# Altium schematic sheet MCU_CONNECTA.SchDoc
size A2
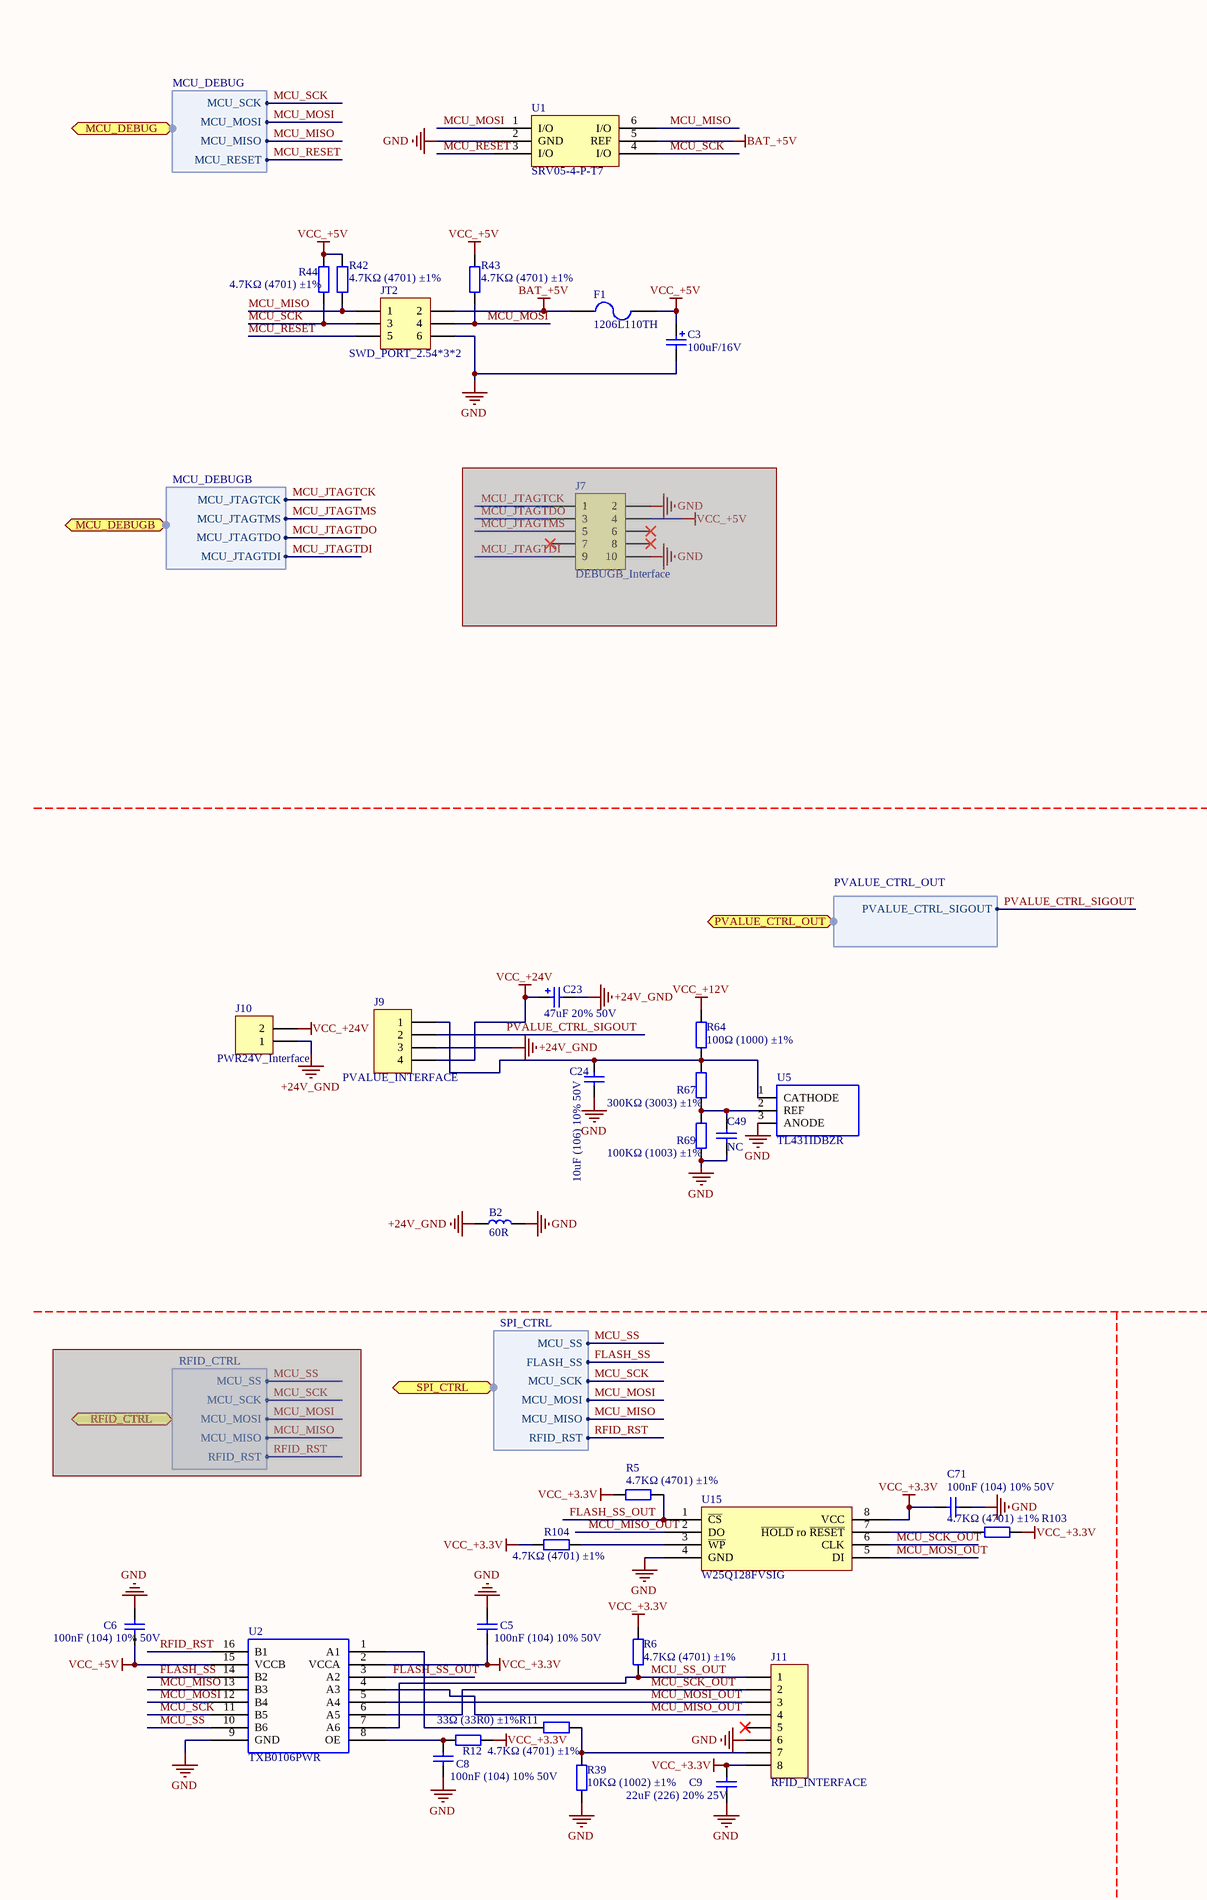
[diagram p0: MCU_CONNECTA.SchDoc, left]
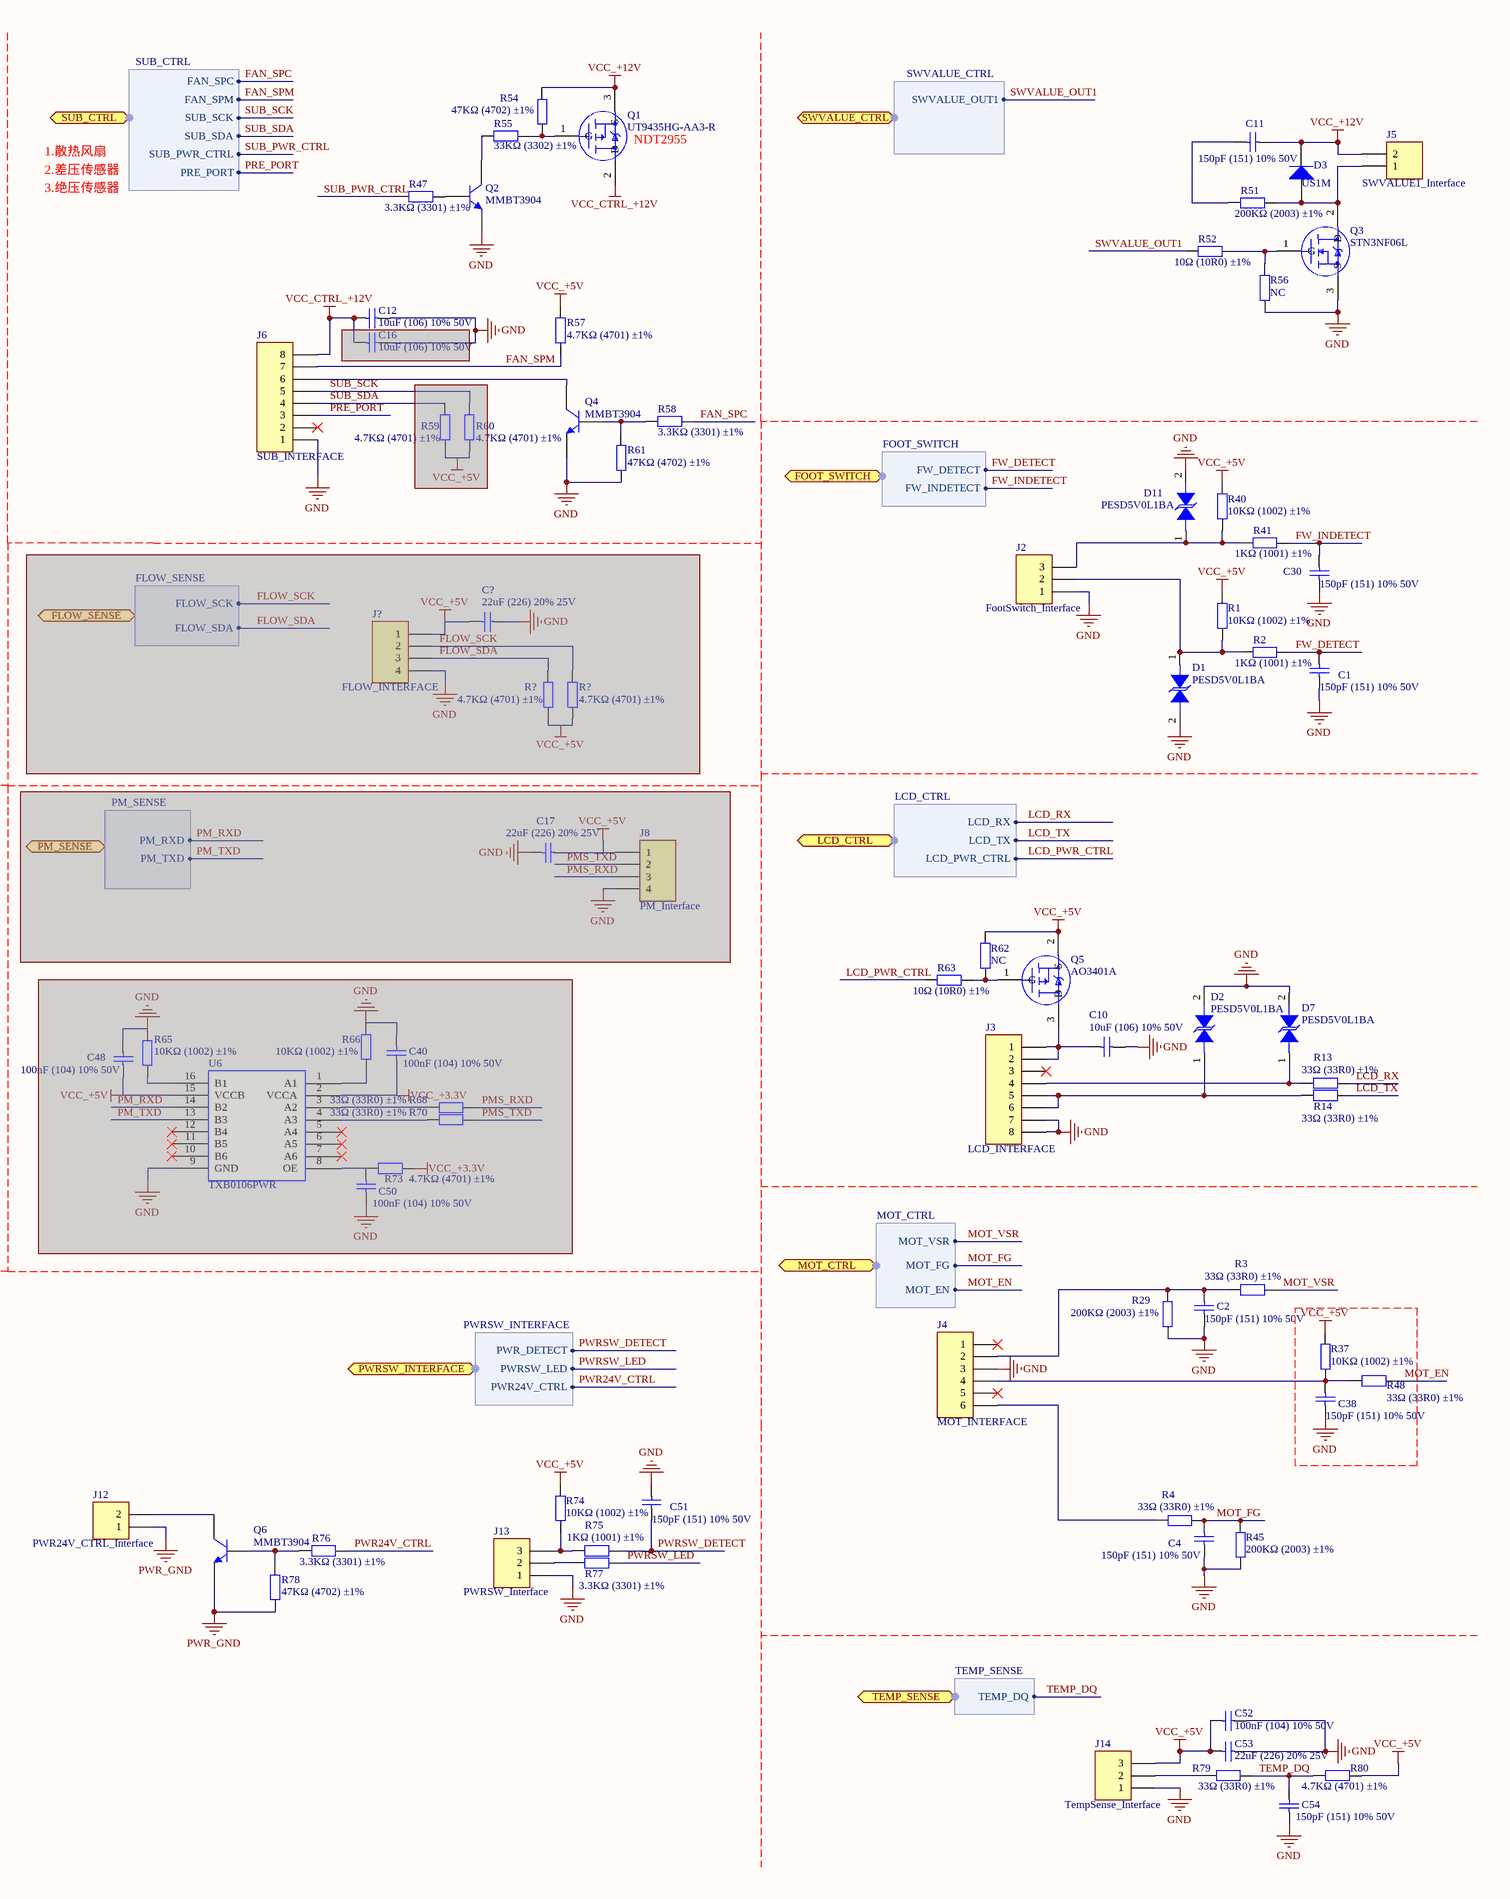
[diagram p1: MCU_CONNECTA.SchDoc, right]

## Parts
(Parts that share a designator on the sheet are numbered #1, #2 ... from top to bottom, then left to right.)
B2  60R  [LC-0805_L]
C1  150pF (151) 10% 50V  [LC-0603_C]
C2  150pF (151) 10% 50V  [LC-0603_C]
C3  100uF/16V  [RCCT-6032C]
C4  150pF (151) 10% 50V  [LC-0603_C]
C5  100nF (104) 10% 50V  [LC-0603_C]
C6  100nF (104) 10% 50V  [LC-0603_C]
C8  100nF (104) 10% 50V  [LC-0603_C]
C9  22uF (226) 20% 25V  [LC-0805_C]
C10  10uF (106) 10% 50V  [LC-1206_C]
C11  150pF (151) 10% 50V  [LC-0603_C]
C12  10uF (106) 10% 50V  [LC-1206_C]
C16  10uF (106) 10% 50V  [LC-1206_C]
C17  22uF (226) 20% 25V  [LC-0805_C]  (masked out: inside a compile mask, not in the netlist)
C23  47uF 20% 50V  [RCC-AL-EC-6.3*7.7-TH]
C24  10uF (106) 10% 50V  [LC-1206_C]
C30  150pF (151) 10% 50V  [LC-0603_C]
C38  150pF (151) 10% 50V  [LC-0603_C]
C40  100nF (104) 10% 50V  [LC-0603_C]  (masked out: inside a compile mask, not in the netlist)
C48  100nF (104) 10% 50V  [LC-0603_C]  (masked out: inside a compile mask, not in the netlist)
C49  NC  [LC-0603_C]
C50  100nF (104) 10% 50V  [LC-0603_C]  (masked out: inside a compile mask, not in the netlist)
C51  150pF (151) 10% 50V  [LC-0603_C]
C52  100nF (104) 10% 50V  [LC-0603_C]
C53  22uF (226) 20% 25V  [LC-0805_C]
C54  150pF (151) 10% 50V  [LC-0603_C]
C71  100nF (104) 10% 50V  [LC-0603_C]
C?  22uF (226) 20% 25V  [LC-0805_C]  (masked out: inside a compile mask, not in the netlist)
D1  PESD5V0L1BA  [RCD-SOD323-N]
D2  PESD5V0L1BA  [RCD-SOD323-N]
D3  US1M  [LC-SMA(DO-214AC)_S1]
D7  PESD5V0L1BA  [RCD-SOD323-N]
D11  PESD5V0L1BA  [RCD-SOD323-N]
F1  1206L110TH  [RCF1206TH]
J2  FootSwitch_Interface  [RCJ2.5-3CA]
J3  LCD_INTERFACE  [RCJ-XH2.54-8P]
J4  MOT_INTERFACE  [RCJ-XH2.54-6P]
J5  SWVALUE1_Interface  [RCJ3.96-2CA]
J6  SUB_INTERFACE  [RCJ-XH2.54-8P]
J7  DEBUGB_Interface  [RCJ2.5-2X5CA]  (masked out: inside a compile mask, not in the netlist)
J8  PM_Interface  [RCJ2.5-4CA]  (masked out: inside a compile mask, not in the netlist)
J9  PVALUE_INTERFACE  [RCJ2.5-4CA]
J10  PWR24V_Interface  [RCJ3.96-2CA]
J11  RFID_INTERFACE  [RCJ-XH2.54-8P]
J12  PWR24V_CTRL_Interface  [RCJ-XH2.54-2P]
J13  PWRSW_Interface  [RCJ2.5-3CA]
J14  TempSense_Interface  [RCJ2.5-3CA]
J?  FLOW_INTERFACE  (masked out: inside a compile mask, not in the netlist)
JT2  SWD_PORT_2.54*3*2  [RCJ2.5-2X3CA]
Q1  UT9435HG-AA3-R  [LC-SOT-223]
Q2  MMBT3904  [LC-SOT-23(SOT-23-3)]
Q3  STN3NF06L  [LC-SOT-223]
Q4  MMBT3904  [LC-SOT-23(SOT-23-3)]
Q5  AO3401A  [LC-SOT-23-3L]
Q6  MMBT3904  [LC-SOT-23(SOT-23-3)]
R1  10KΩ (1002) ±1%  [LC-0603_R]
R2  1KΩ (1001) ±1%  [LC-0603_R]
R3  33Ω (33R0) ±1%  [LC-0603_R]
R4  33Ω (33R0) ±1%  [LC-0603_R]
R5  4.7KΩ (4701) ±1%  [LC-0603_R]
R6  4.7KΩ (4701) ±1%  [LC-0603_R]
R11  33Ω (33R0) ±1%  [LC-0603_R]
R12  4.7KΩ (4701) ±1%  [LC-0603_R]
R13  33Ω (33R0) ±1%  [LC-0603_R]
R14  33Ω (33R0) ±1%  [LC-0603_R]
R29  200KΩ (2003) ±1%  [LC-0603_R]
R37  10KΩ (1002) ±1%  [LC-0603_R]
R39  10KΩ (1002) ±1%  [LC-0603_R]
R40  10KΩ (1002) ±1%  [LC-0603_R]
R41  1KΩ (1001) ±1%  [LC-0603_R]
R42  4.7KΩ (4701) ±1%  [LC-0603_R]
R43  4.7KΩ (4701) ±1%  [LC-0603_R]
R44  4.7KΩ (4701) ±1%  [LC-0603_R]
R45  200KΩ (2003) ±1%  [LC-0603_R]
R47  3.3KΩ (3301) ±1%  [LC-0603_R]
R48  33Ω (33R0) ±1%  [LC-0603_R]
R51  200KΩ (2003) ±1%  [LC-0603_R]
R52  10Ω (10R0) ±1%  [LC-0603_R]
R54  47KΩ (4702) ±1%  [LC-0603_R]
R55  33KΩ (3302) ±1%  [LC-0603_R]
R56  NC  [LC-0603_R]
R57  4.7KΩ (4701) ±1%  [LC-0603_R]
R58  3.3KΩ (3301) ±1%  [LC-0603_R]
R59  4.7KΩ (4701) ±1%  [LC-0603_R]  (masked out: inside a compile mask, not in the netlist)
R60  4.7KΩ (4701) ±1%  [LC-0603_R]  (masked out: inside a compile mask, not in the netlist)
R61  47KΩ (4702) ±1%  [LC-0603_R]
R62  NC  [LC-0603_R]
R63  10Ω (10R0) ±1%  [LC-0603_R]
R64  100Ω (1000) ±1%  [LC-0603_R]
R65  10KΩ (1002) ±1%  [LC-0603_R]  (masked out: inside a compile mask, not in the netlist)
R66  10KΩ (1002) ±1%  [LC-0603_R]  (masked out: inside a compile mask, not in the netlist)
R67  300KΩ (3003) ±1%  [LC-0603_R]
R68  33Ω (33R0) ±1%  [LC-0603_R]  (masked out: inside a compile mask, not in the netlist)
R69  100KΩ (1003) ±1%  [LC-0603_R]
R70  33Ω (33R0) ±1%  [LC-0603_R]  (masked out: inside a compile mask, not in the netlist)
R73  4.7KΩ (4701) ±1%  [LC-0603_R]  (masked out: inside a compile mask, not in the netlist)
R74  10KΩ (1002) ±1%  [LC-0603_R]
R75  1KΩ (1001) ±1%  [LC-0603_R]
R76  3.3KΩ (3301) ±1%  [LC-0603_R]
R77  3.3KΩ (3301) ±1%  [LC-0603_R]
R78  47KΩ (4702) ±1%  [LC-0603_R]
R79  33Ω (33R0) ±1%  [LC-0603_R]
R80  4.7KΩ (4701) ±1%  [LC-0603_R]
R103  4.7KΩ (4701) ±1%  [LC-0603_R]
R104  4.7KΩ (4701) ±1%  [LC-0603_R]
R?#1  4.7KΩ (4701) ±1%  [LC-0603_R]  (masked out: inside a compile mask, not in the netlist)
R?#2  4.7KΩ (4701) ±1%  [LC-0603_R]  (masked out: inside a compile mask, not in the netlist)
U1  SRV05-4-P-T7  [LC-SOT-23-6]
U2  TXB0106PWR  [RCIC-TSSOP16]
U5  TL431IDBZR  [RC-SOT-23]
U6  TXB0106PWR  [RCIC-TSSOP16]  (masked out: inside a compile mask, not in the netlist)
U15  W25Q128FVSIG  [LC-SOIC-8_208mil]

## Ports
FLOW_SENSE (harness FLOW_SENSE), FOOT_SWITCH (harness FOOT_SWITCH), LCD_CTRL (harness LCD_CTRL), MCU_DEBUG (harness MCU_DEBUG), MCU_DEBUGB (harness MCU_DEBUGB), MOT_CTRL (harness MOT_CTRL), PM_SENSE (harness PM_SENSE), PVALUE_CTRL_OUT (harness PVALUE_CTRL_OUT), PWRSW_INTERFACE (harness PWRSW_INTERFACE), RFID_CTRL (harness RFID_CTRL), SPI_CTRL (harness SPI_CTRL), SUB_CTRL (harness SUB_CTRL), SWVALUE_CTRL (harness SWVALUE_CTRL), TEMP_SENSE (harness TEMP_SENSE)

## Harnesses
LCD_CTRL: LCD_RX, LCD_TX, LCD_PWR_CTRL
FOOT_SWITCH: FW_DETECT, FW_INDETECT
MOT_CTRL: MOT_VSR, MOT_FG, MOT_EN
FLOW_SENSE: FLOW_SCK, FLOW_SDA
TEMP_SENSE: TEMP_DQ
SWVALUE_CTRL: SWVALUE_OUT1
RFID_CTRL: MCU_SS, MCU_SCK, MCU_MOSI, MCU_MISO, RFID_RST
PM_SENSE: PM_RXD, PM_TXD
PWRSW_INTERFACE: PWR_DETECT, PWRSW_LED, PWR24V_CTRL
SUB_CTRL: FAN_SPC, FAN_SPM, SUB_SCK, SUB_SDA, SUB_PWR_CTRL, PRE_PORT
MCU_DEBUG: MCU_SCK, MCU_MOSI, MCU_MISO, MCU_RESET
MCU_DEBUGB: MCU_JTAGTCK, MCU_JTAGTMS, MCU_JTAGTDO, MCU_JTAGTDI
PVALUE_CTRL_OUT: PVALUE_CTRL_SIGOUT
SPI_CTRL: MCU_SS, MCU_SCK, MCU_MOSI, MCU_MISO, RFID_RST, FLASH_SS

## Nets
+24V_GND: B2.1 C23.2 J9.3 J10.1
BAT_+5V: F1.2 JT2.2 U1.5(REF)
GND: B2.2 C1.1 C2.1 C3.2 C4.1 C5.2 C6.2 C8.1 C9.1 C10.2 C12.2 C16.2 C24.2 C30.1 C38.1 C49.1 C51.2 C52.1 C53.2 C54.1 C71.1 D1.2 D2.2 D7.2 D11.2 J2.1 J3.7 J3.8 J4.3 J6.1 J11.6 J13.1 J14.1 JT2.6 Q2.2(E) Q3.3(S) Q4.2(E) R29.1 R39.1 R45.1 R56.1 R61.1 R69.2 U1.2(GND) U2.9(GND) U5.3(ANODE) U15.4(GND)
PWR_GND: J12.1 Q6.2(E) R78.1
VCC_+3.3V: C5.1 C9.2 C71.2 J11.8 R5.2 R6.1 R12.2 R103.1 R104.2 U2.2(VCCA) U15.8(VCC)
VCC_+5V: C3.1 C6.1 C52.2 C53.1 F1.1 J14.3 Q5.2(S) R1.2 R37.1 R40.2 R42.1 R43.1 R44.1 R57.2 R62.2 R74.2 R80.2 U2.15(VCCB)
VCC_+12V: C11.1 D3.2(K) J5.2 Q1.3(S) R54.2 R64.2
VCC_+24V: C23.1 J9.4 J10.2
VCC_CTRL_+12V: C12.1 C16.1 J6.8 Q1.2(D)
FAN_SPC: R58.2 ; port SUB_CTRL.FAN_SPC
FAN_SPM: J6.7 R57.1 ; port SUB_CTRL.FAN_SPM
FLASH_SS: U2.14(B2) ; port SPI_CTRL.FLASH_SS
FLASH_SS_OUT: R5.1 U2.3(A2) U15.1(~{CS})
FW_DETECT: C1.2 R2.2 ; port FOOT_SWITCH.FW_DETECT
FW_INDETECT: C30.2 R41.2 ; port FOOT_SWITCH.FW_INDETECT
LCD_PWR_CTRL: R63.1 ; port LCD_CTRL.LCD_PWR_CTRL
LCD_RX: R13.2 ; port LCD_CTRL.LCD_RX
LCD_TX: R14.2 ; port LCD_CTRL.LCD_TX
MCU_JTAGTCK: port MCU_DEBUGB.MCU_JTAGTCK
MCU_JTAGTDI: port MCU_DEBUGB.MCU_JTAGTDI
MCU_JTAGTDO: port MCU_DEBUGB.MCU_JTAGTDO
MCU_JTAGTMS: port MCU_DEBUGB.MCU_JTAGTMS
MCU_MISO: JT2.1 R42.2 U1.6(I/O) U2.13(B3) ; port MCU_DEBUG.MCU_MISO, port SPI_CTRL.MCU_MISO
MCU_MISO_OUT: J11.4 U2.4(A3) U15.2(DO)
MCU_MOSI: JT2.4 R43.2 U1.1(I/O) U2.12(B4) ; port MCU_DEBUG.MCU_MOSI, port SPI_CTRL.MCU_MOSI
MCU_MOSI_OUT: J11.3 U2.5(A4) U15.5(DI)
MCU_RESET: JT2.5 U1.3(I/O) ; port MCU_DEBUG.MCU_RESET
MCU_SCK: JT2.3 R44.2 U1.4(I/O) U2.11(B5) ; port MCU_DEBUG.MCU_SCK, port SPI_CTRL.MCU_SCK
MCU_SCK_OUT: J11.2 U2.6(A5) U15.6(CLK)
MCU_SS: U2.10(B6) ; port SPI_CTRL.MCU_SS
MCU_SS_OUT: J11.1 R6.2 U2.7(A6)
MOT_EN: R48.2 ; port MOT_CTRL.MOT_EN
MOT_FG: C4.2 R4.2 R45.2 ; port MOT_CTRL.MOT_FG
MOT_VSR: R3.2 ; port MOT_CTRL.MOT_VSR
PRE_PORT: J6.3 ; port SUB_CTRL.PRE_PORT
PVALUE_CTRL_SIGOUT: J9.2 ; port PVALUE_CTRL_OUT.PVALUE_CTRL_SIGOUT
PWR24V_CTRL: R76.2 ; port PWRSW_INTERFACE.PWR24V_CTRL
PWRSW_DETECT: C51.1 R75.2 ; port PWRSW_INTERFACE.PWR_DETECT
PWRSW_LED: R77.2 ; port PWRSW_INTERFACE.PWRSW_LED
RFID_RST: U2.16(B1) ; port SPI_CTRL.RFID_RST
SUB_PWR_CTRL: R47.1 ; port SUB_CTRL.SUB_PWR_CTRL
SUB_SCK: J6.5 ; port SUB_CTRL.SUB_SCK
SUB_SDA: J6.4 ; port SUB_CTRL.SUB_SDA
SWVALUE_OUT1: R52.1 ; port SWVALUE_CTRL.SWVALUE_OUT1
TEMP_DQ: C54.2 R79.2 R80.1 ; port TEMP_SENSE.TEMP_DQ
NetC2_2: C2.2 J4.2 R3.1 R29.2
NetC8_2: C8.2 R12.1 U2.8(OE)
NetC10_1: C10.1 J3.1 J3.2 Q5.3(D)
NetC11_2: C11.2 R51.1
NetC24_1: C24.1 J9.1 R64.1 R67.2 U5.1(CATHODE)
NetC38_2: C38.2 J4.4 R37.2 R48.1
NetC49_2: C49.2 R67.1 R69.1 U5.2(REF)
NetD1_1: D1.1 J2.2 R1.1 R2.1
NetD2_1: D2.1 J3.5 J3.6 R14.1
NetD3_1: D3.1(A) J5.1 Q3.2(D) R51.2
NetD7_1: D7.1 J3.4 R13.1
NetD11_1: D11.1 J2.3 R40.1 R41.1
NetJ4_6: J4.6 R4.1
NetJ6_6: J6.6 Q4.3(C)
NetJ11_7: J11.7 R11.2 R39.2
NetJ12_2: J12.2 Q6.3(C)
NetJ13_2: J13.2 R77.1
NetJ13_3: J13.3 R74.1 R75.1
NetJ14_2: J14.2 R79.1
NetQ1_1: Q1.1(G) R54.1 R55.2
NetQ2_1: Q2.1(B) R47.2
NetQ2_3: Q2.3(C) R55.1
NetQ3_1: Q3.1(G) R52.2 R56.2
NetQ4_1: Q4.1(B) R58.1 R61.2
NetQ5_1: Q5.1(G) R62.1 R63.2
NetQ6_1: Q6.1(B) R76.1 R78.2
NetR11_1: R11.1 U2.1(A1)
NetR103_2: R103.2 U15.7(~{HOLD}_ro_~{RESET})
NetR104_1: R104.1 U15.3(~{WP})

Not connected (* = marked no-connect by the designer): J3 3*; J4 1* 5*; J6 2*; J11 5*

## Notes on the sheet
- 1.散热风扇
- (near Q1) NDT2955
- 2.差压传感器
- 3.绝压传感器
- 项目
- 时间
- 版本/修订
- 编制
- 第
- 审核
- 张
- 共
- 备注

## Library data of the parts
B2 = Bead: Bead,1400mA; Manufacture: muRata(村田); Ordering: BLM21PG221SN1; Comments: 60R; Libnum: *; LC: http://item.szlcsc.com/87016.html; LC Supplier Part Number: C85840
C1 C2 C4 C11 C30 C38 C49 C51 C54 = 0603 150pF (151) 10% 50V: 贴片电容; ComponentLink1Description: 供应商链接; ComponentLink1URL: http://www.szlcsc.com/product/details_1946.html; Package: 0603; Supplier: LC; SuppliersPartNumber: C1594
C3 = Cap_polar: 有极性电容; Manufacture: AVX; Ordering: TAJB226M020RNJ; Comments: 100uF/16V; Libnum: *
C5 C6 C8 C40 C48 C50 C52 C71 = 0603 100nF (104) 10% 50V: 贴片电容; ComponentLink1Description: 供应商链接; ComponentLink1URL: http://www.szlcsc.com/product/details_15331.html; Package: 0603; Supplier: LC; SuppliersPartNumber: C14663
C9 C17 C53 C? = 0805 22uF (226) 20% 25V: 贴片电容; ComponentLink1Description: 供应商链接; ComponentLink1URL: http://www.szlcsc.com/product/details_46786.html; Package: 0805; Supplier: LC; SuppliersPartNumber: C45783
C10 C12 C16 C24 = 1206 10uF (106) 10% 50V: 贴片电容; ComponentLink1Description: 供应商链接; ComponentLink1URL: http://www.szlcsc.com/product/details_14236.html; Package: 1206; Supplier: LC; SuppliersPartNumber: C13585
C23 = Cap_polar: 有极性电容; Manufacture: ST; Ordering: CS1H470M-CRE77; Comments: 47uF 20% 50V; Libnum: *
D1 D2 D7 D11 = TVS Diode: TVS; Manufacture: nexperia; Ordering: ESD5V32D-LC; Comments: PESD5V0L1BA; Libnum: *
D3 = SMA(DO-214AC) US1M: 二极管; ComponentLink1Description: 供应商链接; ComponentLink1URL: http://www.szlcsc.com/product/details_5885.html; Package: SMA(DO-214AC); Supplier: LC; SuppliersPartNumber: C5441
F1 = FUSE: Manufacture: LittleFuse; Comments: 1206L110TH; Libnum: *; Ordering: 1206L110TH
J2 J13 J14 = JCJ-1-3: 3 Pin 接插件; Lib: *; Manufacture: *; Ordering: *; LC: *
  J2: Comments: FootSwitch_Interface
  J13: Comments: PWRSW_Interface
  J14: Comments: TempSense_Interface
J3 J6 J11 = Header 8: Header, 8-Pin; LatestRevisionDate: 17-Jul-2002; LatestRevisionNote: Re-released for DXP Platform.; Publisher: Altium Limited
J4 = Header 6: Header, 6-Pin; LatestRevisionDate: 17-Jul-2002; LatestRevisionNote: Re-released for DXP Platform.; Publisher: Altium Limited
J5 J10 J12 = Header 2: Header, 2-Pin; LatestRevisionDate: 17-Jul-2002; LatestRevisionNote: Re-released for DXP Platform.; Publisher: Altium Limited
J7 = Header 5X2: Header, 5-Pin, Dual row; LatestRevisionDate: 17-Jul-2002; LatestRevisionNote: Re-released for DXP Platform.; Publisher: Altium Limited
J8 J9 J? = SWD_PORT: Libnum: *; Manufacture: *; Odering: *
  J8: Comments: PM_Interface
  J9: Comments: PVALUE_INTERFACE
  J?: Comments: FLOW_INTERFACE
JT2 = SWD_PORT_2.54*3*2: MCU Debug Port 6 Pin for Atmega MCU; Comments: SWD_PORT_2.54*3*2; Libnum: *; Manufacture: *; Odering: *
Q1 = PMOS—SOT223: PMOS; Comments: UT9435HG-AA3-R; Manufacture: *; Libnum: *; Ordering: *
Q2 Q4 Q6 = SOT-23 SS8050 Y1: 三极管; Package: SOT-23
Q3 = NMOS
Q5 = PMOS—SOT23: PMOS; Comments: AO3401A; Manufacture: *; Libnum: *; Ordering: *
R1 R37 R39 R40 R65 R66 R74 = 0603 10KΩ (1002) 1%: 贴片电阻; ComponentLink1Description: 供应商链接; ComponentLink1URL: http://www.szlcsc.com/product/details_26547.html; Package: 0603; Supplier: LC; SuppliersPartNumber: C25804
R2 R41 R75 = 0603 1KΩ (1001) 1%: 贴片电阻; ComponentLink1Description: 供应商链接; ComponentLink1URL: http://www.szlcsc.com/product/details_21904.html; Package: 0603; Supplier: LC; SuppliersPartNumber: C21190
R3 R4 R11 R13 R14 R48 R68 R70 R79 = 0603 33Ω (33R0) 1%: 贴片电阻; ComponentLink1Description: 供应商链接; ComponentLink1URL: http://www.szlcsc.com/product/details_23867.html; Package: 0603; Supplier: LC; SuppliersPartNumber: C23140
R5 R6 R12 R42-R44 R57 R59 R60 R73 R80 R103 R104 R?#1 R?#2 = 0603 4.7KΩ (4701) 1%: 贴片电阻; ComponentLink1Description: 供应商链接; ComponentLink1URL: http://www.szlcsc.com/product/details_23889.html; Package: 0603; Supplier: LC; SuppliersPartNumber: C23162
R29 R45 R51 = 0603 200KΩ (2003) 1%: 贴片电阻; ComponentLink1Description: 供应商链接; ComponentLink1URL: http://www.szlcsc.com/product/details_26554.html; Package: 0603; Supplier: LC; SuppliersPartNumber: C25811
R47 R58 R76 R77 = 0603 3.3KΩ (3301) 1%: 贴片电阻; ComponentLink1Description: 供应商链接; ComponentLink1URL: http://www.szlcsc.com/product/details_23705.html; Package: 0603; Supplier: LC; SuppliersPartNumber: C22978
R52 R63 = 0603 10Ω (10R0) 1%: 贴片电阻; ComponentLink1Description: 供应商链接; ComponentLink1URL: http://www.szlcsc.com/product/details_23586.html; Package: 0603; Supplier: LC; SuppliersPartNumber: C22859
R54 R61 R78 = 0603 47KΩ (4702) 1%: 贴片电阻; ComponentLink1Description: 供应商链接; ComponentLink1URL: http://www.szlcsc.com/product/details_26562.html; Package: 0603; Supplier: LC; SuppliersPartNumber: C25819
R55 = 0603 33KΩ (3302) 1%: 贴片电阻; ComponentLink1Description: 供应商链接; ComponentLink1URL: http://www.szlcsc.com/product/details_4623.html; Package: 0603; Supplier: LC; SuppliersPartNumber: C4216
R56 R62 R69 = 0603 100KΩ (1003) 1%: 贴片电阻; ComponentLink1Description: 供应商链接; ComponentLink1URL: http://www.szlcsc.com/product/details_26546.html; Package: 0603; Supplier: LC; SuppliersPartNumber: C25803
R64 = 0603 100Ω (1000) 1%: 贴片电阻; ComponentLink1Description: 供应商链接; ComponentLink1URL: http://www.szlcsc.com/product/details_23502.html; Package: 0603; Supplier: LC; SuppliersPartNumber: C22775
R67 = 0603 300KΩ (3003) 1%: 贴片电阻; ComponentLink1Description: 供应商链接; ComponentLink1URL: http://www.szlcsc.com/product/details_23751.html; Package: 0603; Supplier: LC; SuppliersPartNumber: C23024
U1 = SRV05-4-P-T7: TVS; ComponentLink1Description: 供应商链接; ComponentLink1URL: http://www.szlcsc.com/product/details_86537.html; Package: SOT-23-6; Supplier: LC; SuppliersPartNumber: C85364
U2 U6 = TXB0106: Octal D type transparent latch; Manufacture: TI; Comments: TXB0106PWR; Libnum: *; Ordering: TXB0106PWR
U5 = TL431: Voltage Precise; Manufacture: TI; Comments: TL431IDBZR; Ordering: TL431IDBZR
U15 = W25Q128FVSIG: Flash ROM; ComponentLink1Description: 供应商链接; ComponentLink1URL: http://www.szlcsc.com/product/details_36072.html; Package: SOIC-8; Supplier: LC; SuppliersPartNumber: C35101